# Altium schematic sheet MQ-3.SchDoc
size A4; SheetNumber: 4; SheetTotal: 6
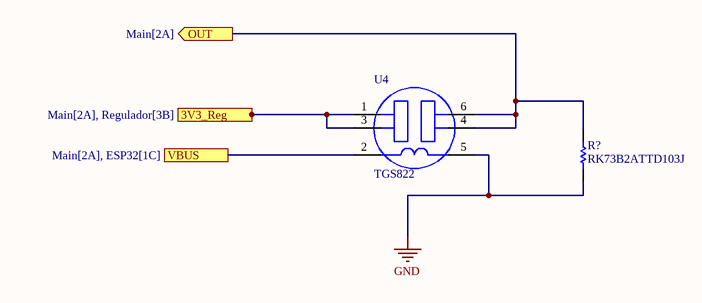
[diagram p0: MQ-3.SchDoc]

## Parts
R?  RK73B2ATTD103J  [RESC2013X60X30NL20T20]
U4  TGS822  [FP-TGS822-MFG]

## Ports
3V3_Reg (see Main[2A], Regulador[3B]), OUT (out, see Main[2A]), VBUS (see Main[2A], ESP32[1C])

## Nets
GND: R?.1 U4.5(GND)
3V3_Reg: U4.1(VC) U4.3(VC) ; port 3V3_Reg
OUT: R?.2 U4.4(VRL) U4.6(VRL) ; port OUT
VBUS: U4.2(VH) ; port VBUS

## Library data of the parts
R? = CMP-2001-04657-1: RL; Manufacturer: KOA Speer; Part Number: RK73B2ATTD103J
U4 = CMP-04312-24208239-1: TGS822 MOS-Type organic solvent vapors sensor; range: 50-5000ppm C2H5OH; supply: 5V; power: 660mW; Max Supply Voltage: 24V; NexarPartId: 24208239; Height: 10mm; RoHS: Compliant; Case/Package: Radial